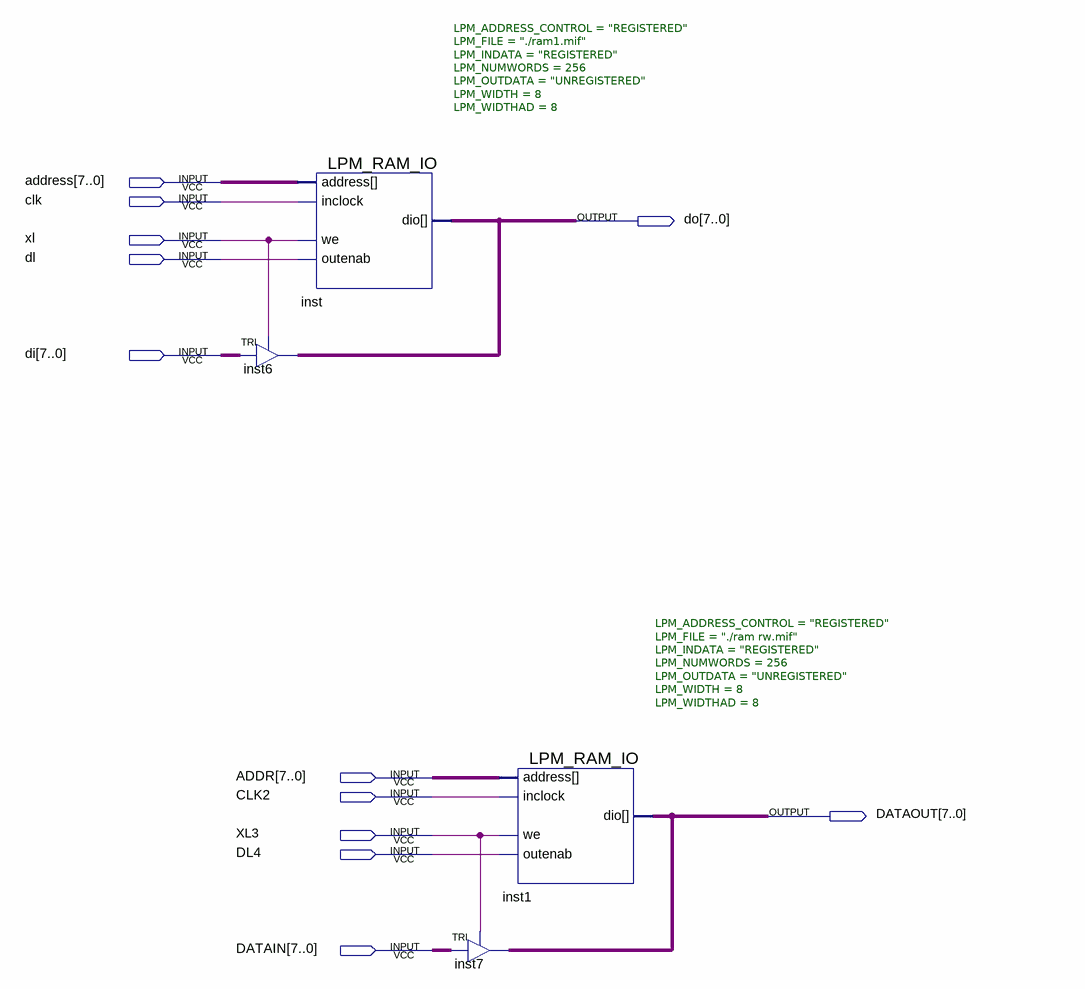
[diagram p0: schematic sheet]
// Quartus schematic ram.bdf as structural Verilog: 4 symbols, 12 pins
module ram (
  input  [7:0] address,
  input  clk,
  input  xl,
  input  dl,
  input  [7:0] di,
  input  [7:0] ADDR,
  input  CLK2,
  input  XL3,
  input  DL4,
  input  [7:0] DATAIN,
  output [7:0] \do ,
  output [7:0] DATAOUT
);

  TRI inst6[7:0] (.IN(di), .OE(xl), .OUT(\do ));
  LPM_RAM_IO #(.LPM_ADDRESS_CONTROL("REGISTERED"), .LPM_FILE("./ram1.mif"), .LPM_INDATA("REGISTERED"), .LPM_NUMWORDS(256), .LPM_OUTDATA("UNREGISTERED"), .LPM_WIDTH(8), .LPM_WIDTHAD(8)) inst (
    .address(address), .inclock(clk), .we(xl), .outenab(dl), .dio(\do ));
  TRI inst7[7:0] (.IN(DATAIN), .OE(XL3), .OUT(DATAOUT));
  LPM_RAM_IO #(.LPM_ADDRESS_CONTROL("REGISTERED"), .LPM_FILE("./ram rw.mif"), .LPM_INDATA("REGISTERED"), .LPM_NUMWORDS(256), .LPM_OUTDATA("UNREGISTERED"), .LPM_WIDTH(8), .LPM_WIDTHAD(8)) inst1 (
    .address(ADDR), .inclock(CLK2), .we(XL3), .outenab(DL4), .dio(DATAOUT));
endmodule
